# Altium schematic sheet v1.0.SchDoc
size 83 x 55 mm
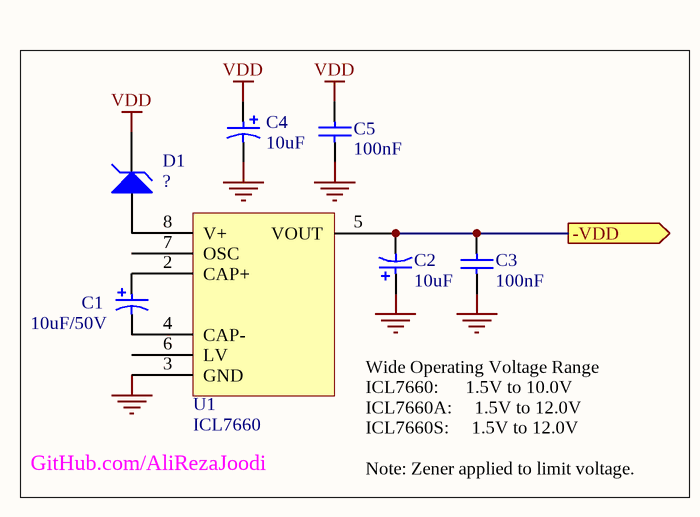
[diagram p0: v1.0.SchDoc]

## Parts
C1  10uF/50V  [C_THD_EL_(P2.54-D6-H11)]
C2  10uF  [C_THD_EL_(P2.54-D6-H11)]
C3  100nF  [C_THD_CER_(P2.54-D3.5-T1.5)]
C4  10uF  [C_THD_EL_(P2.54-D6-H11)]
C5  100nF  [C_THD_CER_(P2.54-D3.5-T1.5)]
D1  ?  [DIODE0.4_Glass]
U1  ICL7660  [DIP_8]

## Ports
-VDD (out)

## Nets
GND: C2.1 C3.1 C4.2 C5.2 U1.3(GND)
VDD: C4.1 C5.1 D1.2(K)
-VDD: C2.2 C3.2 U1.5(VOUT) ; port -VDD
NetC1_1: C1.1 U1.2(CAP+)
NetC1_2: C1.2 U1.4(CAP-)
NetD1_1: D1.1(A) U1.8(V+)

Not connected (* = marked no-connect by the designer): U1 6(LV) 7(OSC)

## Notes on the sheet
- (near U1) GitHub.com/AliRezaJoodi
- (near U1) Wide Operating Voltage Range
  ICL7660:	     1.5V to 10.0V
  ICL7660A:     1.5V to 12.0V
  ICL7660S:     1.5V to 12.0V
  Note: Zener applied to limit voltage.

## Library data of the parts
C1 C2 C4 = Capacitor_Electrolytic: Capacitor, Electrolytic; Revision: July-2002: Re-released for DXP Platform.
C3 C5 = Capacitor_Ceramic: Capacitor, Ceramic Multilayer; Revision: July-2002: Re-released for DXP Platform.
D1 = D Zener: Zener Diode; Manufacturer: Generic Components; Class I: Discrete; Class II: Diode - Zener; Published: 8-Jun-2000; Revision: July-2002: Re-released for DXP Platform.; Publisher: Altium Limited